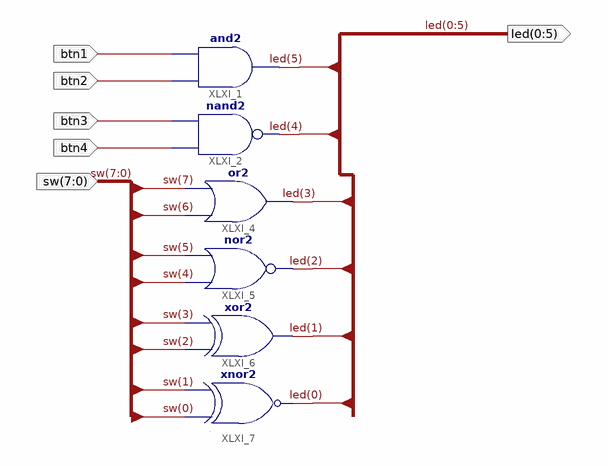
[diagram p0: schematic sheet 1]
// Xilinx ISE schematic scheme.sch (spartan6) as structural Verilog: 6 symbols, 7 ports
module scheme (
  input  btn1,
  input  btn2,
  input  btn3,
  input  btn4,
  input  [7:0] sw,
  output [0:5] led
);

  and XLXI_1 (led[5], btn2, btn1);
  nand XLXI_2 (led[4], btn4, btn3);
  or XLXI_4 (led[3], sw[6], sw[7]);
  nor XLXI_5 (led[2], sw[4], sw[5]);
  xor XLXI_6 (led[1], sw[2], sw[3]);
  xnor XLXI_7 (led[0], sw[0], sw[1]);
endmodule
